# EAGLE design soeng_proto_board_1 (EAGLE 9.6.2)
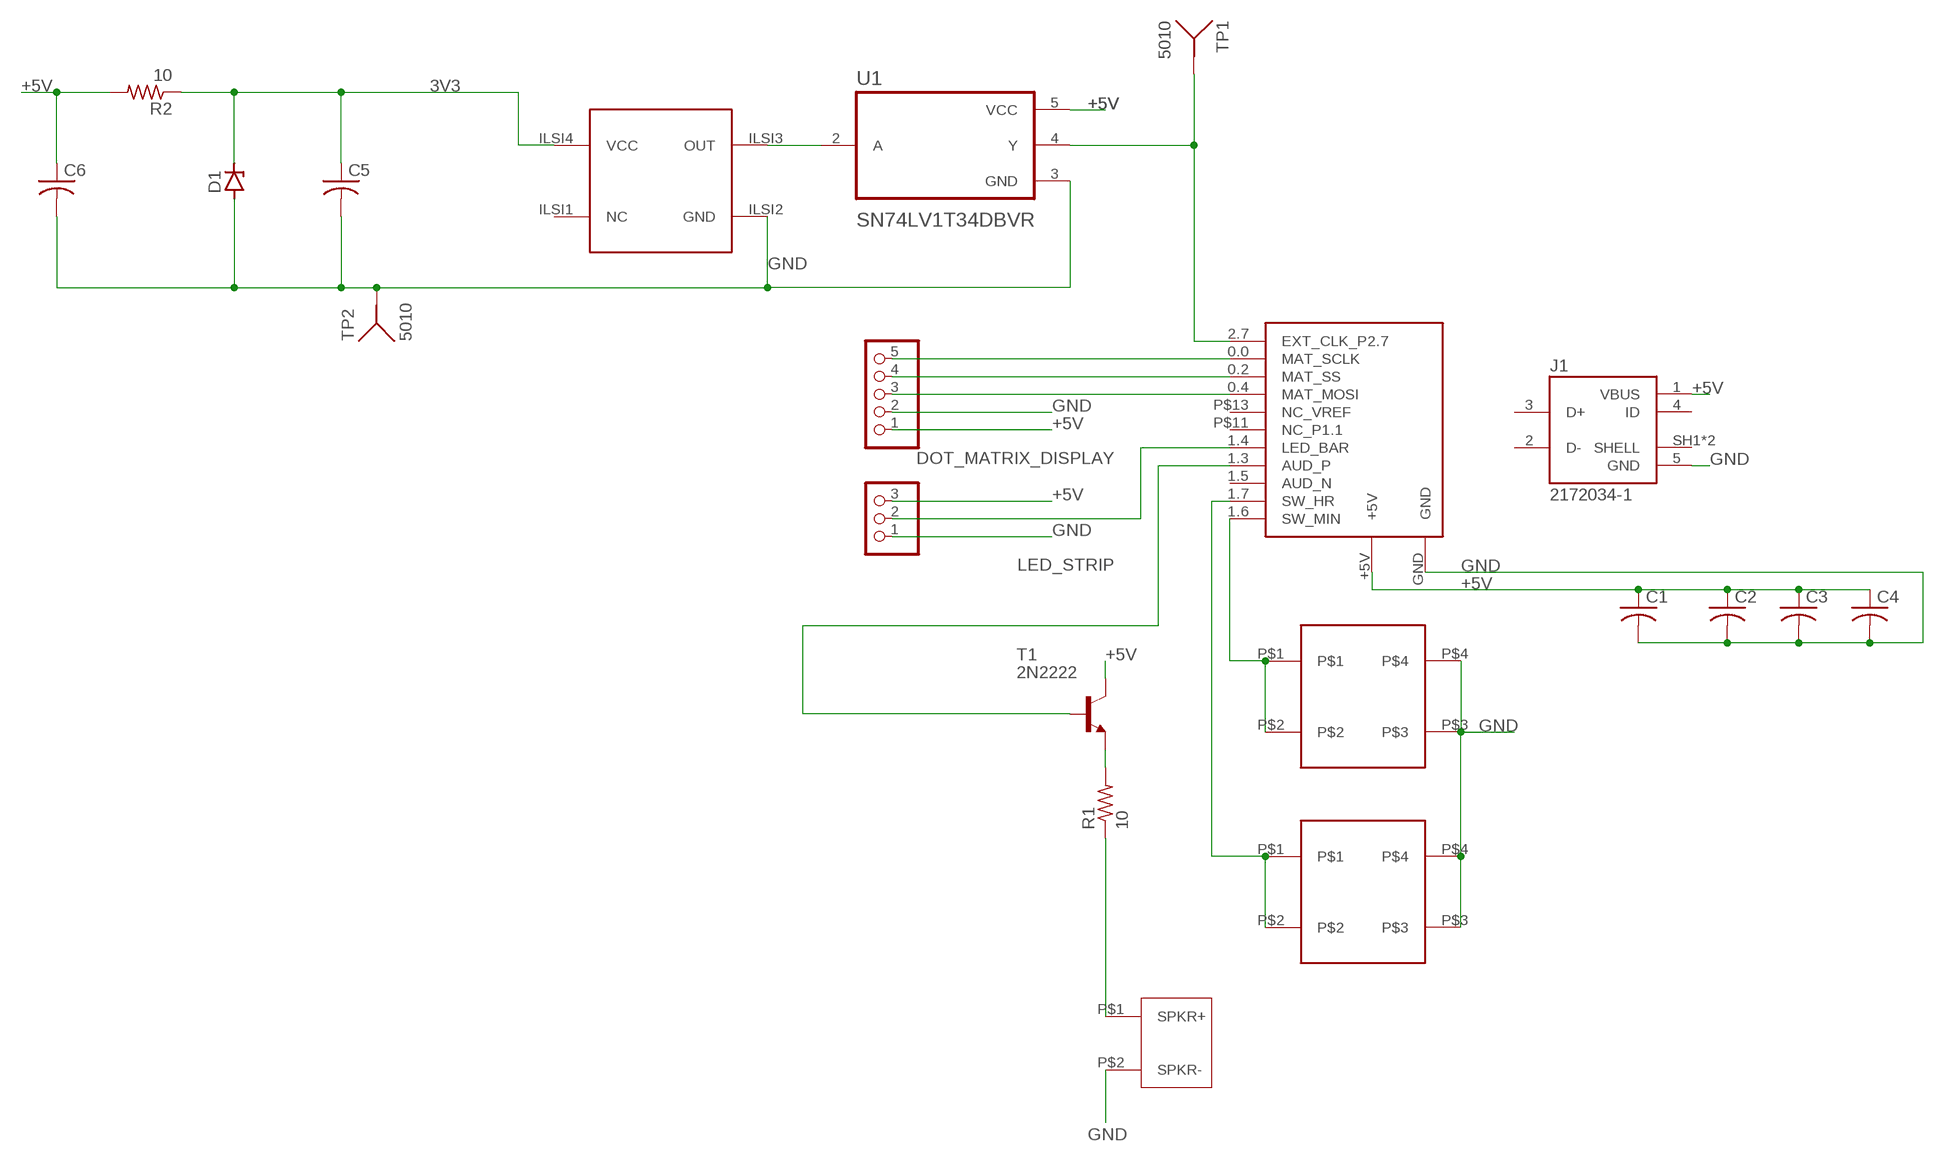
[diagram p0: schematic, sheet 1]

## Parts
C1  C-US025-025X050  [C025-025X050]
C2  C-US025-025X050  [C025-025X050]
C3  C-US025-025X050  [C025-025X050]
C4  C-US025-025X050  [C025-025X050]
C5  C-US025-025X050  [C025-025X050]
C6  C-US025-025X050  [C025-025X050]
D1  ZENER-DIODEZD-10  [ZDIO-10]
DOT_MATRIX_DISPLAY  PINHD-1X5  [1X05]
J1  2172034-1  [TE_2172034-1]
LED_STRIP  PINHD-1X3  [1X03]
R1  10  R-US_0207/9  [0207/9]
R2  10  R-US_0207/9  [0207/9]
T1  2N2222  [TO92-EBC-OVAL]
TP1  5010  [TP_5010]
TP2  5010  [TP_5010]
U1  SN74LV1T34DBVR  [SOT95P280X145-5N]
U$1  CY8CKIT-149  [CY8CKIT-142]
U$2  RDI-PUSHBUTTON  [RDI-PUSHBUTTON]
U$3  RDI-PUSHBUTTON  [RDI-PUSHBUTTON]
U$4  MICRO_SPKR  [MICRO_SPKR]
U$5  ILSI-I538  [ILSI-I538SERIES]

## Nets
3V3: C5.1 D1.C R2.1 U$5.ILSI4(VCC)
+5V: C1.1 C2.1 C3.1 C4.1 C6.1 DOT_MATRIX_DISPLAY.1 J1.1(VBUS) LED_STRIP.3 R2.2 T1.C U1.5(VCC) U$1.+5V
GND: C1.2 C2.2 C3.2 C4.2 C5.2 C6.2 D1.A DOT_MATRIX_DISPLAY.2 J1.5(GND) LED_STRIP.1 TP2.1 U1.3(GND) U$1.GND U$2.P$3 U$2.P$4 U$3.P$3 U$3.P$4 U$4.P$2(SPKR-) U$5.ILSI2(GND)
N$1: DOT_MATRIX_DISPLAY.5 U$1.0.0(MAT_SCLK)
N$2: DOT_MATRIX_DISPLAY.4 U$1.0.2(MAT_SS)
N$3: DOT_MATRIX_DISPLAY.3 U$1.0.4(MAT_MOSI)
N$4: T1.B U$1.1.3(AUD_P)
N$5: LED_STRIP.2 U$1.1.4(LED_BAR)
N$6: R1.2 T1.E
N$7: U$1.1.7(SW_HR) U$3.P$1 U$3.P$2
N$8: U$1.1.6(SW_MIN) U$2.P$1 U$2.P$2
N$9: R1.1 U$4.P$1(SPKR+)
N$10: TP1.1 U1.4(Y) U$1.2.7(EXT_CLK_P2.7)
N$11: U1.2(A) U$5.ILSI3(OUT)
Unconnected: J1.2(D-) J1.3(D+) J1.4(ID) U$1.1.5(AUD_N) U$1.P$11(NC_P1.1) U$1.P$13(NC_VREF) U$5.ILSI1(NC)

## Power pins joined to a net without a drawn wire
SHELL: J1.SH1(SHELL) J1.SH2(SHELL)

## Library data of the parts
C1-C6 = adafruit:C-US: CAPACITOR, American symbol
D1 = diode:ZENER-DIODE: Z-Diode
DOT_MATRIX_DISPLAY = pinhead:PINHD-1X5: PIN HEADER
J1 = TE-Mini-USB:2172034-1: CONN RCPT USB MINI B 2.0 PCB R/A; COMMENT: 2172034-1; DESCRIPTION: Conn Mini USB Type B RCP 5 POS 0.8mm Solder RA Thru-Hole 5 Terminal 1 Port Box/Tray; DIGI-KEY_PART_NUMBER: A135698-ND; EU_ROHS_COMPLIANCE: Compliant; MF: TE Connectivity; MP: 2172034-1; PACKAGE: None; PURCHASE-URL: https://pricing.snapeda.com/search/part/2172034-1/?ref=eda
LED_STRIP = pinhead:PINHD-1X3: PIN HEADER
R1 R2 = adafruit:R-US_: RESISTOR, American symbol
T1 = adafruit:2N2222: NPN TRANSISTOR Big oval pads
TP1 TP2 = 5010:5010: Test Point; Red; Thru-Hole; Snap-Fit; SilverPlate; 0.063in. Dia.; 0.445In. Check prices <https://pricing.snapeda.com/parts/5010/Laird%20Technologies/view-part?ref=eda>; AVAILABILITY: Good; DESCRIPTION: RF EMI Absorbing Sheet - Polyurethane Foam 24.000 (609.60mm) X 24.000 (609.60mm) X 0.252 (6.40mm); MF: Laird Technologies; MP: 5010; PACKAGE: SOIC-8 Laird Technologies; PRICE: None; PURCHASE-URL: https://pricing.snapeda.com/search/part/5010/?ref=eda
U1 = SN74LV1T34DBVR:SN74LV1T34DBVR; DESCRIPTION: Single Power Supply BUFFER Logic Level Shifter (no enable); DIGI-KEY_PART_NUMBER: 296-37176-2-ND; MF: Texas Instruments; MP: SN74LV1T34DBVR; PACKAGE: SOT-23-5 Texas Instruments; PURCHASE-URL: https://pricing.snapeda.com/search/part/SN74LV1T34DBVR/?ref=eda
U$1 = lap_2019:CY8CKIT-149
U$2 U$3 = lap_2019:RDI-PUSHBUTTON
U$4 = lap_2019:MICRO_SPKR
U$5 = lap_2019:ILSI-I538

## Board
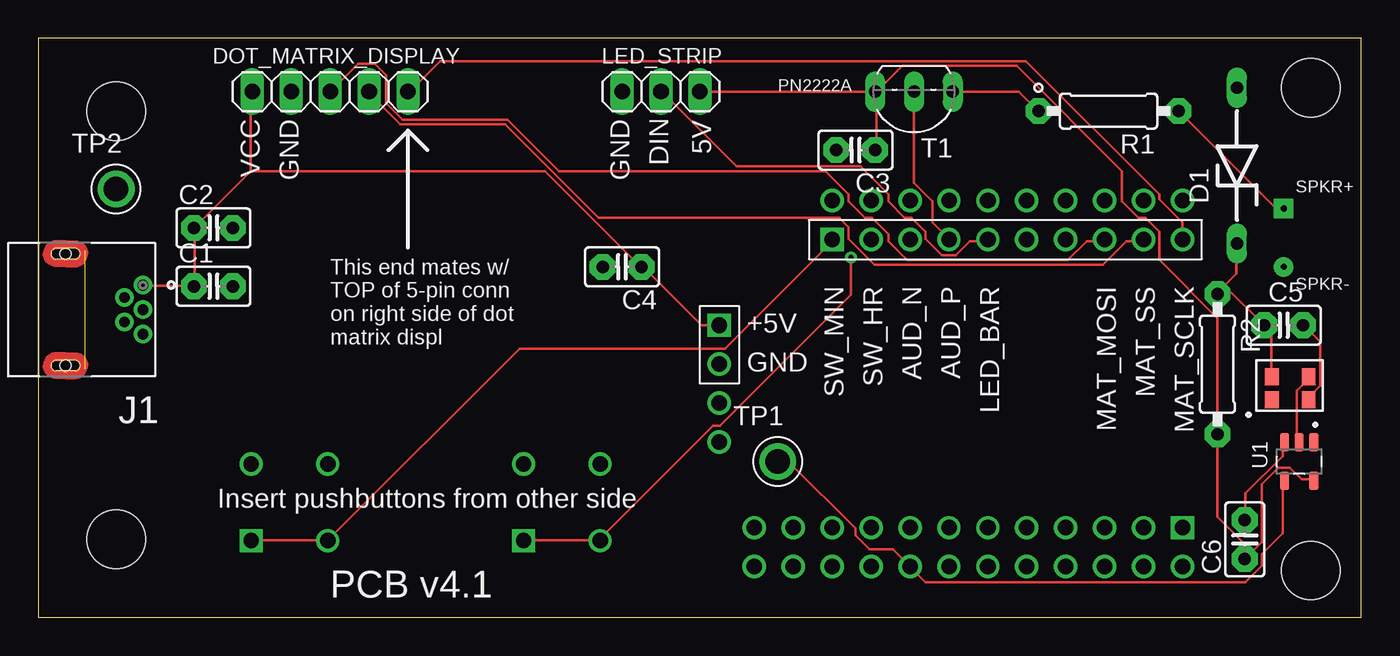
[diagram p1: board, top side]
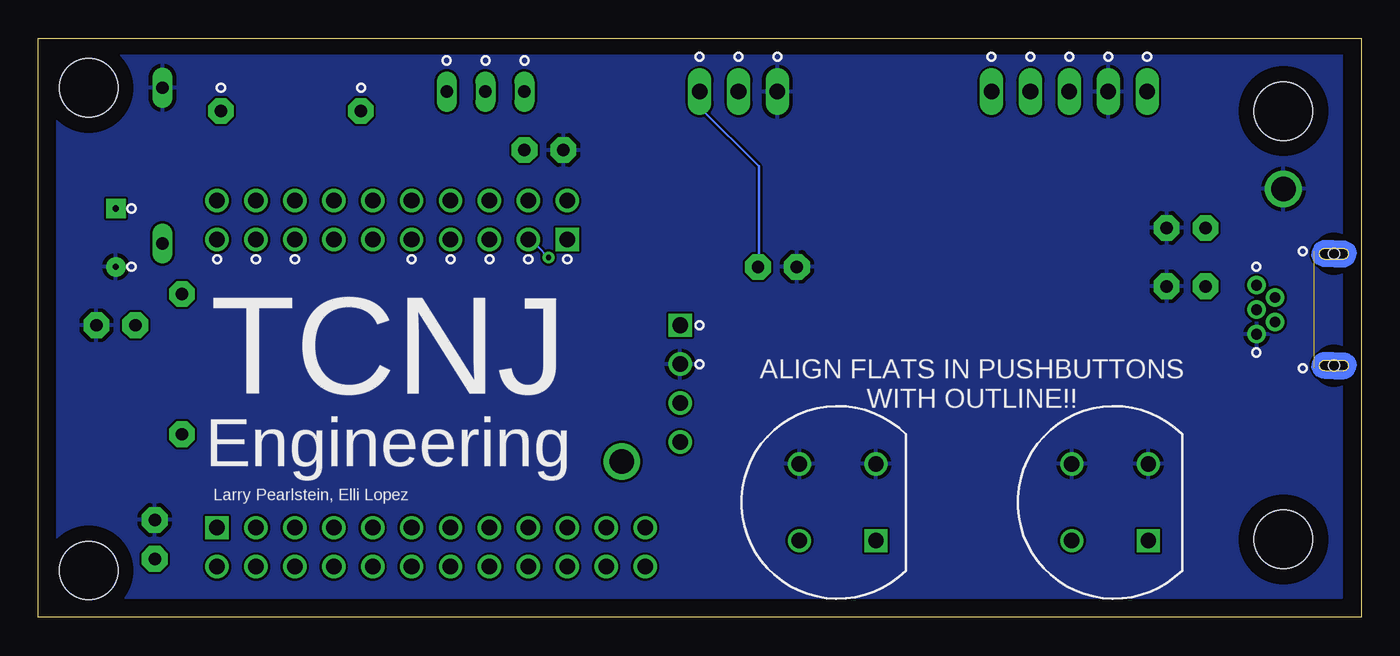
[diagram p2: board, bottom side, seen from below]

Size 86.34 x 37.77 mm. Coordinates in mm from the lower left corner, seen from the top.
Outline: 0,0 86.34,0 86.34,37.77 0,37.77 0,0
Copper layers (1*16): Top 0.035mm / dielectric 1.5mm / Bottom 0.035mm
Design rules "default": minimum track width 6mil, minimum drill 0.35mm, track to track 6mil, track to pad 6mil, pad to pad 6mil, via to via 6mil, smd to smd 6mil, copper to edge 40mil, drill to drill 6mil, minimum pad ring 10mil, minimum via ring 8mil, stop-mask expansion 4mil, vias tented up to drill 0mil, thermal gap 10mil
Holes 3.81 mm at 5.08,33.02 5.08,5.08 83.06,3.05 83.06,34.54

### Footprints (pad centres in the part's own frame; a part is rotated, then mirrored left to right if it is on the bottom)
C025-025X050 = drill 0.813 pad 1.676 octagon: 1 -1.27,0; 2 1.27,0
ZDIO-10 = drill 0.813 long: A 5.08,0; C -5.08,0
1X05 = drill 1.016 long: 1 -5.08,0; 2 -2.54,0; 3 0,0; 4 2.54,0; 5 5.08,0
TE_2172034-1 = drill 0.7: 1 -5.05,-1.6; 2 -3.85,-0.8; 3 -5.05,0; 4 -3.85,0.8; 5 -5.05,1.6 | smd 0.1 x 0.1: SH1 -1.27,3.81; SH2 -1.27,-3.81 | hole 0.7: 0,3.65; 0,-3.65
1X03 = drill 1.016 long: 1 -2.54,0; 2 0,0; 3 2.54,0
0207/9 = drill 0.813 pad 1.676 octagon: 1 -4.572,0; 2 4.572,0
TO92-EBC-OVAL = drill 0.813 long: B 0,-1.27; C 2.54,-1.27; E -2.54,-1.27
TP_5010 = drill 1.6: 1 0,0
SOT95P280X145-5N = smd 1.21 x 0.59: 1 -1.255,0.95; 2 -1.255,0; 3 -1.255,-0.95; 4 1.255,-0.95; 5 1.255,0.95
CY8CKIT-142 = drill 1.016: 0.0 -4.318,31.496; 0.2 -4.318,28.956; 0.4 -4.318,26.416; 1.3 -4.318,16.256; 1.4 -4.318,18.796; 1.5 -4.318,13.716; 1.7 -4.318,11.176; 2.7 17.018,13.716; GND 3.81,1.27; GNDD -6.858,11.176; GNDR 17.018,3.556; P$3 14.478,28.956; P$4 17.018,28.956; P$5 14.478,26.416; P$6 -6.858,13.716; P$7 17.018,26.416; P$8 -6.858,16.256; P$9 14.478,23.876; P$10 -6.858,18.796; P$11 -4.318,21.336; P$12 -6.858,21.336; P$13 -4.318,23.876; P$14 -6.858,23.876; P$15 17.018,23.876; P$16 -6.858,26.416; P$17 14.478,21.336; P$18 -6.858,28.956; P$19 17.018,21.336; P$20 -6.858,31.496; P$21 14.478,18.796; P$22 17.018,18.796; P$23 14.478,16.256; P$24 17.018,16.256; P$25 14.478,13.716; P$27 14.478,11.176; P$28 17.018,11.176; P$29 14.478,8.636; P$30 17.018,8.636; P$31 14.478,6.096; P$32 17.018,6.096; RX 8.89,1.27; TX 6.35,1.27; VDDA 17.018,31.496; VDDD -6.858,8.636; VDDR 14.478,3.556 | drill 1.016 square: 1.6 -4.318,8.636; +5V 1.27,1.27; GNDA 14.478,31.496
RDI-PUSHBUTTON = drill 1 square: P$1 5,5 | drill 1: P$2 10,5; P$3 10,10; P$4 5,10
MICRO_SPKR = drill 0.4 pad 1.27 square: P$1 0,0 | drill 0.4 pad 1.27: P$2 3.81,0
ILSI-I538SERIES = smd 0.9 x 1.1: ILSI1 1,1.5; ILSI2 3.4,1.5; ILSI3 3.4,3; ILSI4 1,3

### Placement (x,y rotation side)
C1  11.43,21.59 0 top
C2  11.43,25.4 0 top
C3  53.34,30.48 180 top
C4  38.1,22.86 180 top
C5  81.28,19.05 0 top
C6  78.74,5.08 90 top
D1  78.23,29.46 90 top
DOT_MATRIX_DISPLAY  19.05,34.29 0 top
J1  1.78,20.07 180 top
LED_STRIP  40.64,34.29 0 top
R1  69.85,33.02 180 top
R2  76.96,16.51 270 top
T1  57.15,33.02 180 top
TP1  48.26,10.16 0 top
TP2  5.08,27.94 0 top
U1  82.3,10.16 270 top
U$1  43.18,20.32 270 top
U$2  8.89,0 0 top
U$3  26.67,0 0 top
U$4  81.28,26.67 270 top
U$5  79.5,12.7 0 top

### Tracks (layer width: path | path; a pad name or v marks a point on that pad's centre or on a via)
3V3
  Top 0.152: U$5.ILSI4 80.47,15.85 80.47,18.59 C5.1 77.42,21.64 | 77.42,21.64 76.96,21.18 R2.1 77.42,21.64 | 77.42,21.64 78.18,22.4 78.18,24.38 D1.C
+5V
  Top 0.152: J1.1 6.86,21.64 10.06,21.64 C1.1 10.21,21.64 10.21,25.3 C2.1 13.87,29.11 | 13.87,29.11 13.87,34.29 DOT_MATRIX_DISPLAY.1 | 79.25,4.27 78.79,3.81 C6.1 79.25,4.27 | 79.25,4.27 79.86,4.88 79.86,8.69 80.92,9.75 81.69,9.75 82.45,8.99 83.21,8.99 U1.5 | 79.25,4.27 76.96,6.55 R2.2 76.96,19.51 73.15,23.32 73.15,25.15 72.24,26.06 71.78,26.06 70.71,27.13 70.71,29.11 63.86,35.97 56.39,35.97 54.71,34.29 | U$1.+5V 43.28,19.05 39.47,22.86 C4.1 39.32,22.86 33.07,29.11 13.87,29.11 | 54.71,34.29 54.71,30.48 C3.1 | LED_STRIP.3 T1.C 54.71,34.29
  Bottom 0.152: C4.1 39.32,22.86 39.32,29.41 43.13,33.22 43.13,34.29 LED_STRIP.3
GND
  Top 0.152: U$5.ILSI2 82.91,14.33 83.67,15.09 83.67,17.98 82.6,19.05 C5.2 | U1.3 81.23,11.28 81.23,10.52 78.79,8.08 78.79,6.4 C6.2
  pour Bottom: 1.27,36.83 1.27,1.27 85.09,1.27 85.09,36.83
N$1
  Top 0.152: U$1.0.0 74.68,25.76 73.15,27.28 73.15,27.58 64.47,36.27 26.21,36.27 24.23,34.29 DOT_MATRIX_DISPLAY.5
N$2
  Top 0.152: U$1.0.2 72.08,24.54 71.02,24.54 69.49,23.01 54.56,23.01 52.88,24.69 52.88,25.45 52.27,26.06 36.58,26.06 30.48,32.16 23.62,32.16 21.49,34.29 DOT_MATRIX_DISPLAY.4
N$3
  Top 0.152: DOT_MATRIX_DISPLAY.3 20.88,36.12 21.95,36.12 22.71,35.36 22.71,33.53 23.77,32.46 30.63,32.46 33.98,29.11 51.36,29.11 52.88,27.58 52.88,27.13 53.95,26.06 54.41,26.06 55.47,24.99 55.47,24.54 56.69,23.32 67.21,23.32 68.43,24.54 69.49,24.54 U$1.0.4
N$4
  Top 0.152: T1.B 57.15,28.35 58.37,27.13 58.37,25.76 59.44,24.69 U$1.1.3
N$5
  Top 0.152: U$1.1.4 61.87,24.54 60.81,24.54 59.89,23.62 58.98,23.62 57.91,24.69 57.91,25.15 57,26.06 56.54,26.06 55.47,27.13 55.47,27.58 53.65,29.41 45.57,29.41 40.69,34.29 LED_STRIP.2
N$6
  Top 0.152: T1.E 64.01,34.29 R1.2
N$7  (via drill 0.35)
  Top 0.152: 36.58,5.03 31.7,5.03 U$3.P$1 | v53.03,23.47 53.03,21.03 44.5,12.5 44.04,12.5 36.58,5.03 | 36.58,5.03 U$3.P$2
  Bottom 0.152: U$1.1.7 53.95,24.23 53.8,24.23 v53.03,23.47
N$8
  Top 0.152: U$2.P$1 14.02,5.03 18.75,5.03 U$2.P$2 18.9,5.03 31.39,17.53 44.81,17.53 51.82,24.54 U$1.1.6
N$9
  Top 0.152: U$4.P$1 80.77,26.67 R1.1
N$10
  Top 0.152: U1.4 81.23,8.84 81.23,5.49 79.86,4.12 79.86,3.35 78.79,2.29 57.91,2.29 U$1.2.7 55.78,4.42 54.25,4.42 53.34,5.33 53.34,5.79 49.07,10.06 48.31,10.06 TP1.1
N$11
  Top 0.152: U$5.ILSI3 82.75,15.7 82.75,15.39 82.14,14.78 82.14,11.58 82.3,11.43 U1.2
SHELL  (1 unrouted)

### Text on the board
tPlace: GND | GND | 5V | VCC
bPlace: TCNJ | Engineering | Larry Pearlstein, Elli Lopez
tNames: PN2222A | DIN | SPKR+ | SPKR- | This end mates w/ / TOP of 5-pin conn / on right side of dot / matrix displ | Insert pushbuttons from other side | PCB v4.1
bNames: ALIGN FLATS IN PUSHBUTTONS / WITH OUTLINE!!